# Altium schematic sheet Voltage Regulation.SchDoc
size A; SheetNumber: 3; SheetTotal: 3
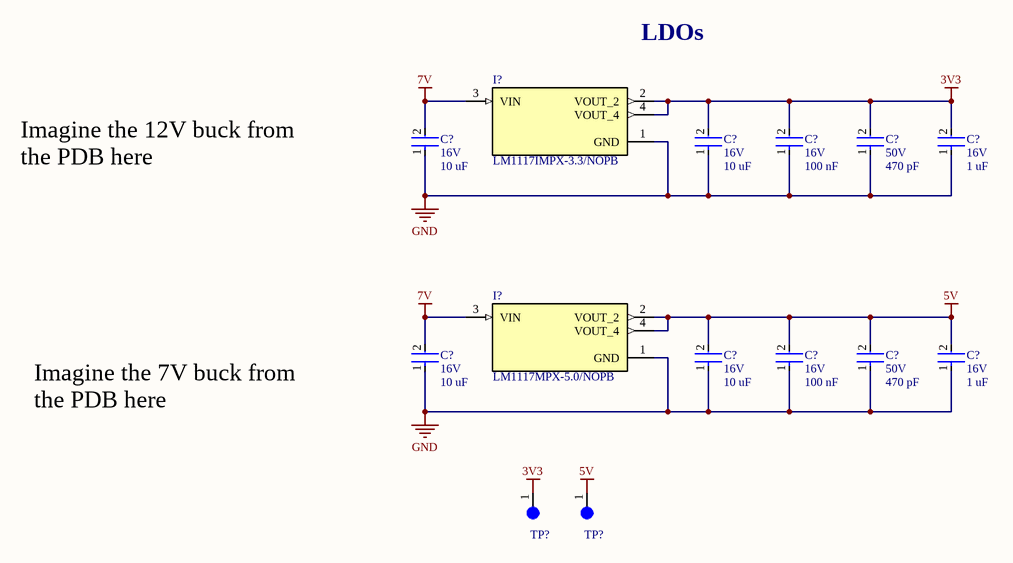
[diagram p0: Voltage Regulation.SchDoc]

## Parts
(Parts that share a designator on the sheet are numbered #1, #2 ... from top to bottom, then left to right.)
C?#1  Voltage Rating: 16V  Capacitance: 10 uF  [CAP-0805]  (hidden comment: CAP 0805)
C?#2  Voltage Rating: 16V  Capacitance: 10 uF  [CAP-0805]  (hidden comment: CAP 0805)
C?#3  Voltage Rating: 16V  Capacitance: 100 nF  [CAP-0805]  (hidden comment: CAP 0805)
C?#4  Voltage Rating: 50V  Capacitance: 470 pF  [CAP-0805]  (hidden comment: CAP 0805)
C?#5  Voltage Rating: 16V  Capacitance: 1 uF  [CAP-0805]  (hidden comment: CAP 0805)
C?#6  Voltage Rating: 16V  Capacitance: 10 uF  [CAP-0805]  (hidden comment: CAP 0805)
C?#7  Voltage Rating: 16V  Capacitance: 10 uF  [CAP-0805]  (hidden comment: CAP 0805)
C?#8  Voltage Rating: 16V  Capacitance: 100 nF  [CAP-0805]  (hidden comment: CAP 0805)
C?#9  Voltage Rating: 50V  Capacitance: 470 pF  [CAP-0805]  (hidden comment: CAP 0805)
C?#10  Voltage Rating: 16V  Capacitance: 1 uF  [CAP-0805]  (hidden comment: CAP 0805)
I?#1  LM1117IMPX-3.3/NOPB  [IC-SOT-223-4]
I?#2  LM1117MPX-5.0/NOPB  [IC-SOT-223-4]
TP?#1  5003  [TEST-POINT-0001]  (value not drawn)
TP?#2  5003  [TEST-POINT-0001]  (value not drawn)

## Nets
3V3: C?#2.2 C?#3.2 C?#4.2 C?#5.2 I?#1.2(VOUT_2) I?#1.4(VOUT_4) TP?#1.1
5V: C?#7.2 C?#8.2 C?#9.2 C?#10.2 I?#2.2(VOUT_2) I?#2.4(VOUT_4) TP?#2.1
7V: C?#1.2 C?#6.2 I?#1.3(VIN) I?#2.3(VIN)
GND: C?#1.1 C?#2.1 C?#3.1 C?#4.1 C?#5.1 C?#6.1 C?#7.1 C?#8.1 C?#9.1 C?#10.1 I?#1.1(GND) I?#2.1(GND)

## Notes on the sheet
- LDOs
- Imagine the 12V buck from the PDB here
- Imagine the 7V buck from the PDB here

## Library data of the parts
I?#1 = IC_LDO_3V3_0001: IC REG LIN 3.3V 800MA SOT223-4; ComponentLink1Description: New link; ComponentLink1URL: https://www.ti.com/lit/ds/symlink/lm1117.pdf?HQS=dis-dk-null-digikeymode-dsf-pf-null-wwe&ts=1721700739746
I?#2 = IC_LDO_5V_0001: IC REG LINEAR 5V 800MA SOT223-4; ComponentLink1Description: Datasheet; ComponentLink1URL: https://www.ti.com/lit/ds/symlink/lm1117.pdf?HQS=dis-dk-null-digikeymode-dsf-pf-null-wwe&ts=1721700739746
TP?#1 TP?#2 = TEST-POINT-0001: Oranange PC Test Point, Miniature Phoisphor Bronze Silver Plating Through Hole Mounting Type